# Altium schematic sheet COOLING.SchDoc
size A; SheetNumber: 5; SheetTotal: 12
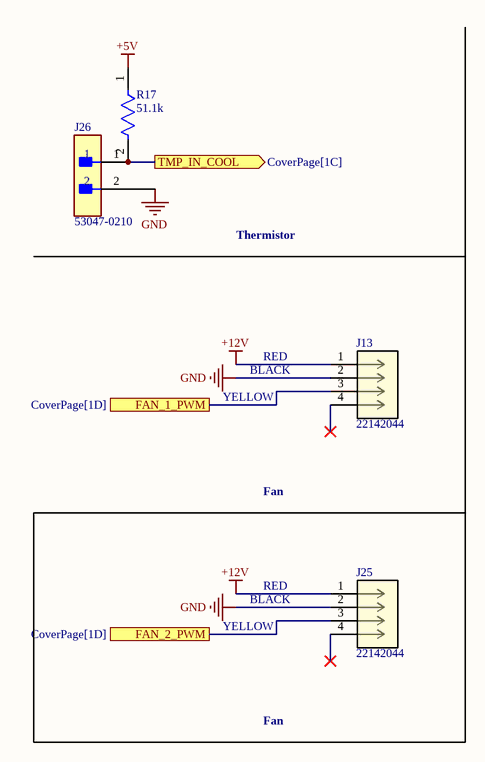
[diagram p0: COOLING.SchDoc]

## Parts
J13  22142044  [CONN_SDA-4455_04_BE_MOL]
J25  22142044  [CONN_SDA-4455_04_BE_MOL]
J26  53047-0210  [FP-53047-0210-MFG]
R17  51.1k  [FP-RG2012-MFG]

## Ports
FAN_1_PWM (see CoverPage[1D]), FAN_2_PWM (see CoverPage[1D]), TMP_IN_COOL (out, see CoverPage[1C])

## Nets
+5V: R17.1
+12V: J13.1 J25.1
GND: J13.2 J25.2 J26.2
FAN_1_PWM: J13.3 ; port FAN_1_PWM
FAN_2_PWM: J25.3 ; port FAN_2_PWM
TMP_IN_COOL: J26.1 R17.2 ; port TMP_IN_COOL

Not connected (* = marked no-connect by the designer): J13 4*; J25 4*

## Notes on the sheet
- Thermistor
- RED
- YELLOW
- BLACK
- Fan

## Library data of the parts
J13 J25 = CMP-129-000000-1: No Description Available; Mfr_Name: Molex Connector Corporation; Design Item ID: 22142044; Type: Type; RefDes: RefDes; Source: 22142044.SchLib
J26 = CMP-2000-05628-3: CONN HEADER VERT 2POS 1.25MM; Manufacturer: Molex; Conn Gender: Male; Voltage Rating: 125V; Conn Orientation: Vertical; Number Of Contacts: 2; Current Rating: 1A; Contact Material: Tin; Temperature Range Low: -40°C; ComponentLink2URL: http://www.molex.com/webdocs/datasheets/pdf/en-us/0530470210_PCB_HEADERS.pdf; Mouser Description: 1.25mm Pitch PicoBlade™ Wire-to-Board Header, Vertical, with Friction Lock, 2 Circuits; Manufacturer Part Number: 53047-0210; Temperature Range High: +85°C; ComponentLink2Description: Datasheet; Automotive: No; RoHS: TRUE; Ambient Temperature Range High: +85°C; Octopart: https://octopart.com/53047-0210-molex-276772; Footprint Url: https://www.molex.com/pdm_docs/sd/530470210_sd.pdf; Lead Free: Yes; Pitch: 1.25mm; Temperature: -40°C to +85°C; Device Class L2: Headers and Wire Housings; Package: 0; Ambient Temperature Range Low: -40°C; Digikey Description: CONN HEADER VERT 2POS 1.25MM; Category: Conn; Device Class L3: unset; Number Of Rows: 1; Device Class L1: Connectors; Height: 4.4mm
R17 = CMP-2001-03008-2: Automotive Metal Thin Film Chip Resistor, 0805, 51.1kΩ, 0.1%, 25ppm/°C, 0.125W, 150V; Power Rating: 125mW; Resistance: 51.1kR; Number of Terminations: 2; Case Code (Imperial): 0805; Height: 0.02inch; Min Operating Temperature: -55°C; Voltage Rating: 150V; Length: 0.079inch; Lead Free: Lead Free; Resistor Type: Thin Film; Tolerance: 0.1%; Weight: 0.000194oz; Termination: SMD/SMT; Max Power Dissipation: 125mW; Packaging: Tape and Reel; Width: 1.2mm; Series: RG; Max Operating Temperature: 155°C; Case/Package: 0805; Temperature Coefficient: 25ppm/°C; Package Quantity: 1; Case Code (Metric): 2012; RoHS Compliant: Yes; Voltage Rating (DC): 150V; Features: Automotive AEC-Q200